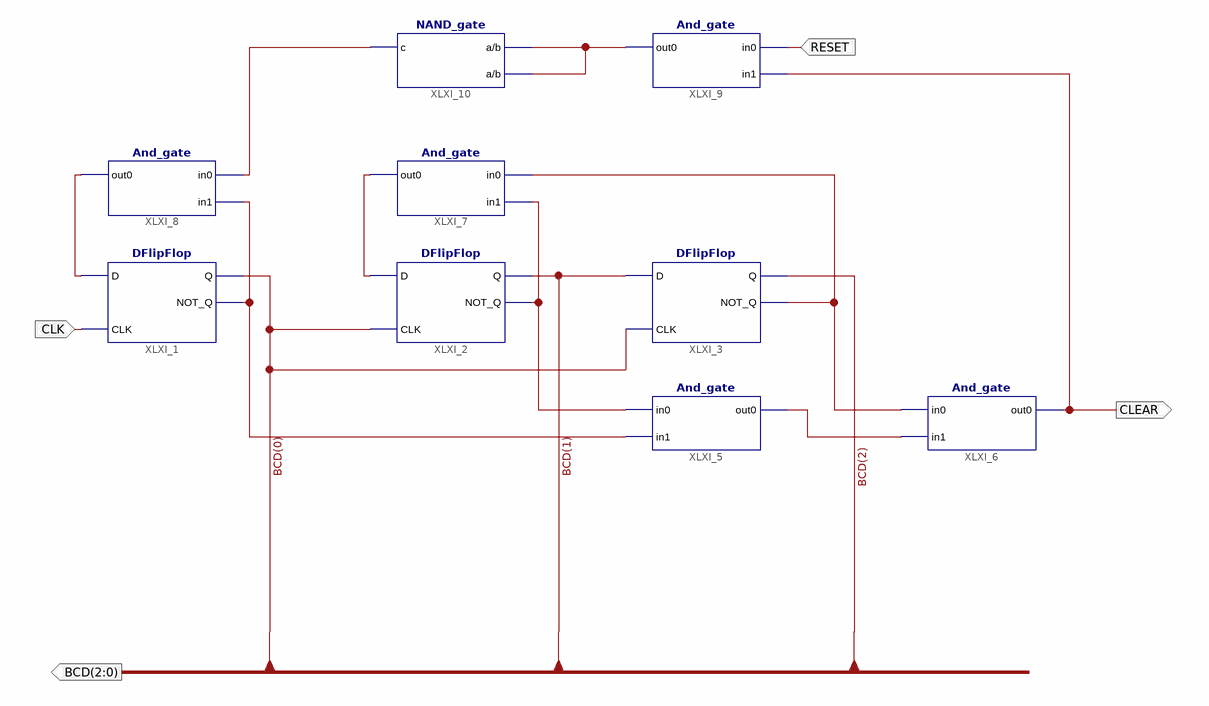
[diagram p0: schematic sheet 1]
// Xilinx ISE schematic BCD_3.sch (spartan6) as structural Verilog: 9 symbols, 4 ports
module BCD_3 (
  input  CLK,
  input  RESET,
  output [2:0] BCD,
  output CLEAR
);

  wire XLXN_11, XLXN_12, XLXN_13, XLXN_14, XLXN_15, XLXN_24, XLXN_25, XLXN_26;

  DFlipFlop XLXI_1 (.D(XLXN_26), .Q(BCD[0]), .NOT_Q(XLXN_14), .CLK(CLK));
  DFlipFlop XLXI_2 (.D(XLXN_15), .Q(BCD[1]), .NOT_Q(XLXN_13), .CLK(BCD[0]));
  DFlipFlop XLXI_3 (.D(BCD[1]), .Q(BCD[2]), .NOT_Q(XLXN_12), .CLK(BCD[0]));
  And_gate XLXI_5 (.in0(XLXN_13), .in1(XLXN_14), .out0(XLXN_11));
  And_gate XLXI_6 (.in0(XLXN_12), .in1(XLXN_11), .out0(CLEAR));
  And_gate XLXI_7 (.in0(XLXN_12), .in1(XLXN_13), .out0(XLXN_15));
  And_gate XLXI_8 (.in0(XLXN_25), .in1(XLXN_14), .out0(XLXN_26));
  And_gate XLXI_9 (.in0(RESET), .in1(CLEAR), .out0(XLXN_24));
  NAND_gate XLXI_10 (.a(XLXN_24), .b(XLXN_24), .c(XLXN_25));
endmodule
